# EAGLE design untitled (EAGLE 9.4.2)
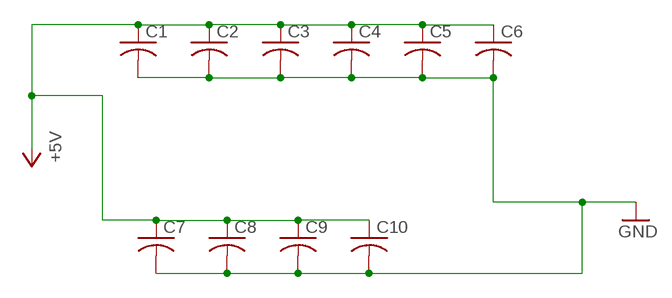
[diagram p0: schematic, sheet 1, part 1 of 2]
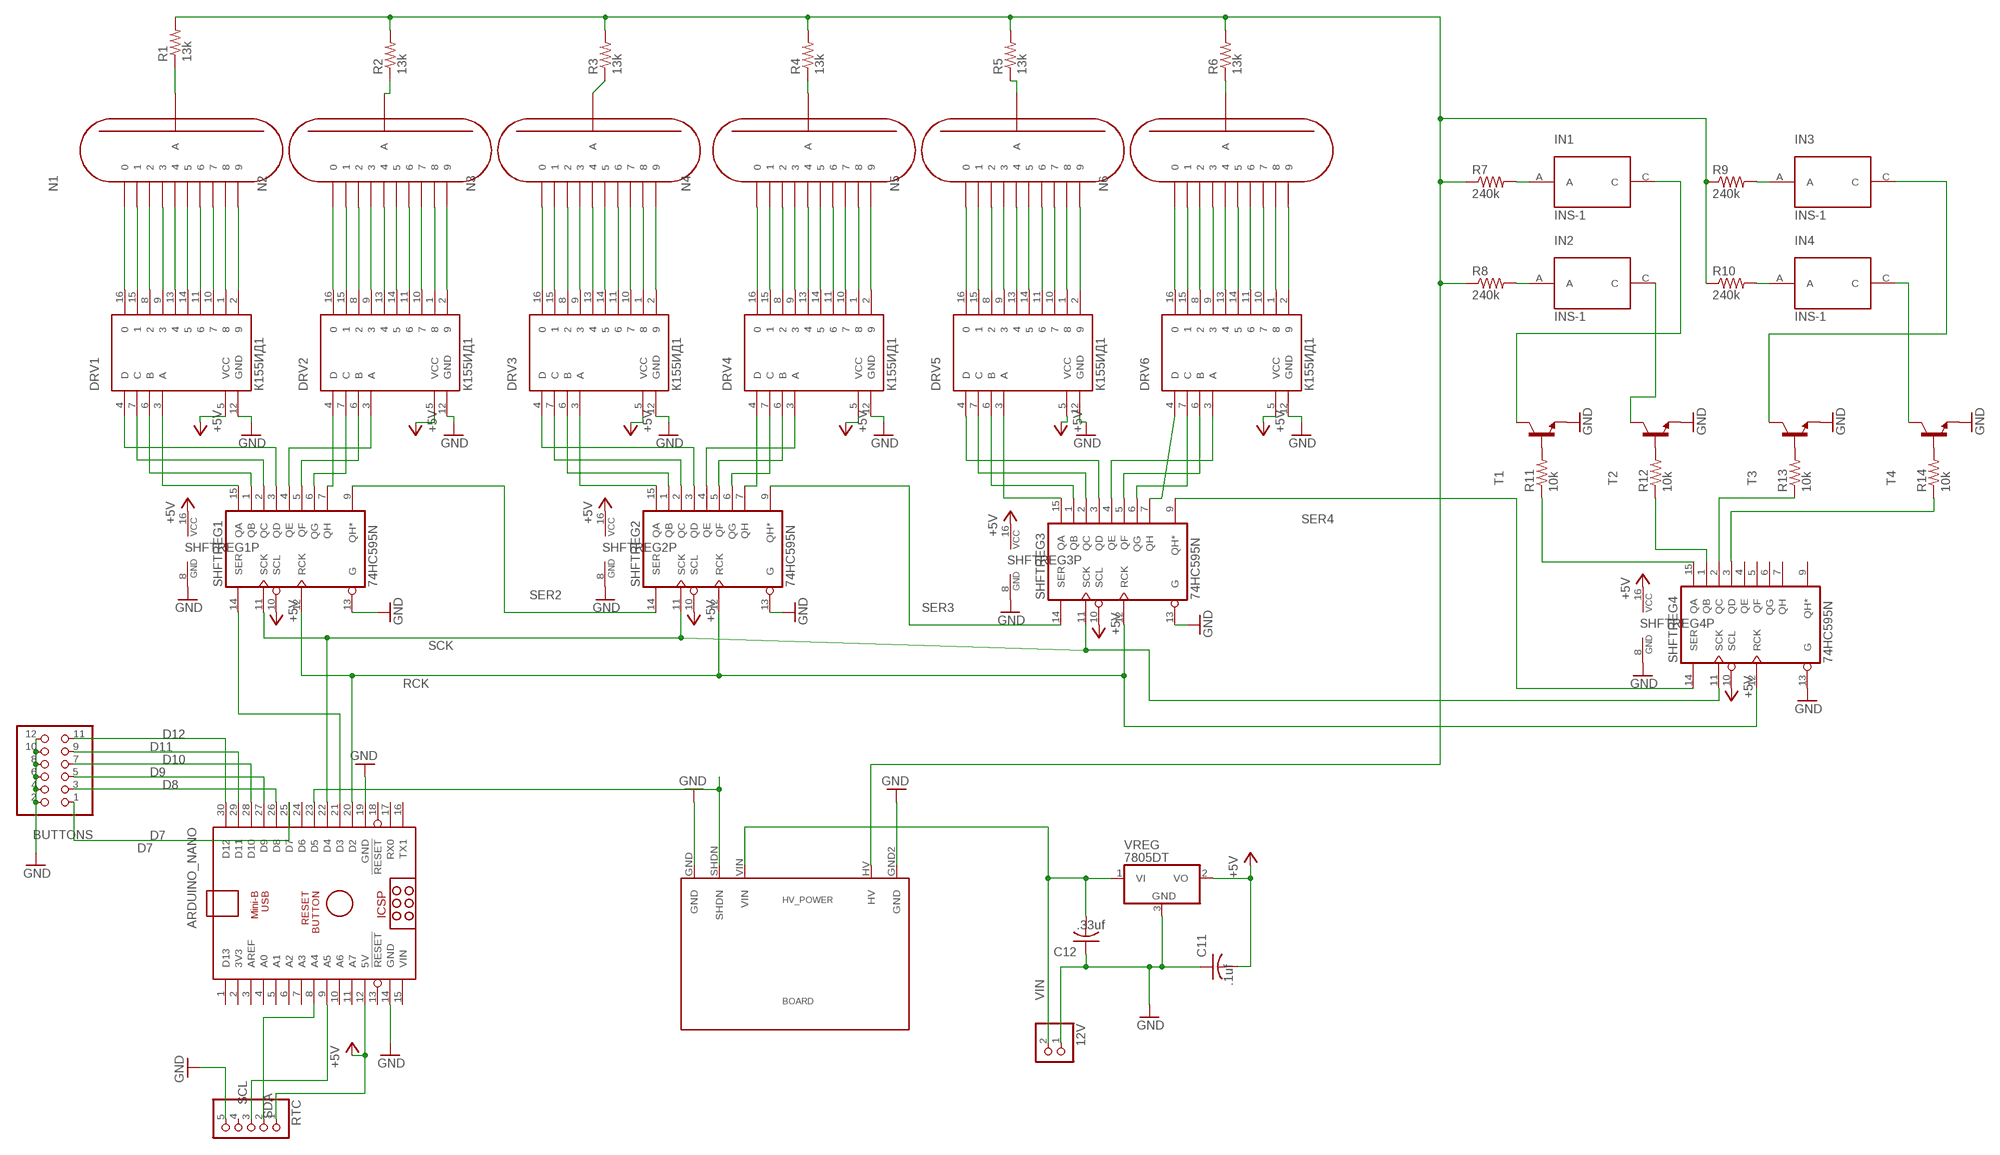
[diagram p1: schematic, sheet 1, part 2 of 2]

## Parts
12V  PINHD-1X2/90  [1X02/90]
ARDUINO_NANO  ARDUINO_NANO  [ARDUINO_NANO]
BUTTONS  PINHD-2X6/90  [2X06/90]
C1  C-USC0805  [C0805]
C2  C-USC0805  [C0805]
C3  C-USC0805  [C0805]
C4  C-USC0805  [C0805]
C5  C-USC0805  [C0805]
C6  C-USC0805  [C0805]
C7  C-USC0805  [C0805]
C8  C-USC0805  [C0805]
C9  C-USC0805  [C0805]
C10  C-USC0805  [C0805]
C11  .1uf  C-USC0805  [C0805]
C12  .33uf  C-USC0805  [C0805]
DRV1  К155ИД1  K155ID1DIL16  [DIL16]
DRV2  К155ИД1  K155ID1DIL16  [DIL16]
DRV3  К155ИД1  K155ID1DIL16  [DIL16]
DRV4  К155ИД1  K155ID1DIL16  [DIL16]
DRV5  К155ИД1  K155ID1DIL16  [DIL16]
DRV6  К155ИД1  K155ID1DIL16  [DIL16]
HV_POWER  BOARD  [BOARD]
IN1  INS-1  [INS-1]
IN2  INS-1  [INS-1]
IN3  INS-1  [INS-1]
IN4  INS-1  [INS-1]
N1  IN-12A  [IN-12]
N2  IN-12A  [IN-12]
N3  IN-12A  [IN-12]
N4  IN-12A  [IN-12]
N5  IN-12A  [IN-12]
N6  IN-12A  [IN-12]
R1  13k  R-US_R0805  [R0805]
R2  13k  R-US_R0805  [R0805]
R3  13k  R-US_R0805  [R0805]
R4  13k  R-US_R0805  [R0805]
R5  13k  R-US_R0805  [R0805]
R6  13k  R-US_R0805  [R0805]
R7  240k  R-US_R0805  [R0805]
R8  240k  R-US_R0805  [R0805]
R9  240k  R-US_R0805  [R0805]
R10  240k  R-US_R0805  [R0805]
R11  10k  R-US_R0805  [R0805]
R12  10k  R-US_R0805  [R0805]
R13  10k  R-US_R0805  [R0805]
R14  10k  R-US_R0805  [R0805]
RTC  PINHD-1X5  [1X05]
SHFTREG1  74HC595N  [DIL16]
SHFTREG2  74HC595N  [DIL16]
SHFTREG3  74HC595N  [DIL16]
SHFTREG4  74HC595N  [DIL16]
T1  MMBTA42LT1-NPN-SOT23-BEC  [SOT23-BEC]
T2  MMBTA42LT1-NPN-SOT23-BEC  [SOT23-BEC]
T3  MMBTA42LT1-NPN-SOT23-BEC  [SOT23-BEC]
T4  MMBTA42LT1-NPN-SOT23-BEC  [SOT23-BEC]
VREG  7805DT  [TO252]

## Nets
+5V: ARDUINO_NANO.12(5V) C1.1 C2.1 C3.1 C4.1 C5.1 C6.1 C7.1 C8.1 C9.1 C10.1 C11.2 DRV1.5(VCC) DRV2.5(VCC) DRV3.5(VCC) DRV4.5(VCC) DRV5.5(VCC) DRV6.5(VCC) RTC.1 SHFTREG1.10(SCL) SHFTREG1.16(VCC) SHFTREG2.10(SCL) SHFTREG2.16(VCC) SHFTREG3.10(SCL) SHFTREG3.16(VCC) SHFTREG4.10(SCL) SHFTREG4.16(VCC) VREG.2(VO)
D7: ARDUINO_NANO.25(D7) BUTTONS.1
D8: ARDUINO_NANO.26(D8) BUTTONS.3
D9: ARDUINO_NANO.27(D9) BUTTONS.5
D10: ARDUINO_NANO.28(D10) BUTTONS.7
D11: ARDUINO_NANO.29(D11) BUTTONS.9
D12: ARDUINO_NANO.30(D12) BUTTONS.11
GND: 12V.1 ARDUINO_NANO.14(GND) ARDUINO_NANO.19(GND) BUTTONS.2 BUTTONS.4 BUTTONS.6 BUTTONS.8 BUTTONS.10 BUTTONS.12 C1.2 C2.2 C3.2 C4.2 C5.2 C6.2 C7.2 C8.2 C9.2 C10.2 C11.1 C12.1 DRV1.12(GND) DRV2.12(GND) DRV3.12(GND) DRV4.12(GND) DRV5.12(GND) DRV6.12(GND) HV_POWER.GND HV_POWER.GND2(GND) RTC.5 SHFTREG1.8(GND) SHFTREG1.13(G) SHFTREG2.8(GND) SHFTREG2.13(G) SHFTREG3.8(GND) SHFTREG3.13(G) SHFTREG4.8(GND) SHFTREG4.13(G) T1.E T2.E T3.E T4.E VREG.3(GND)
N$1: DRV4.4(D) SHFTREG2.7(QH)
N$2: DRV1.16 N1.0
N$3: DRV1.15 N1.1
N$4: DRV1.8 N1.2
N$5: DRV1.9 N1.3
N$6: DRV1.13 N1.4
N$7: DRV1.11 N1.6
N$8: DRV1.14 N1.5
N$9: DRV1.10 N1.7
N$10: DRV1.1 N1.8
N$11: DRV1.2 N1.9
N$12: DRV2.16 N2.0
N$13: DRV2.15 N2.1
N$14: DRV2.8 N2.2
N$15: DRV2.9 N2.3
N$16: DRV2.13 N2.4
N$17: DRV2.14 N2.5
N$18: DRV2.11 N2.6
N$19: DRV2.10 N2.7
N$20: DRV2.1 N2.8
N$21: DRV2.2 N2.9
N$22: DRV3.16 N3.0
N$23: DRV3.15 N3.1
N$24: DRV3.8 N3.2
N$25: DRV3.9 N3.3
N$26: DRV3.13 N3.4
N$27: DRV3.14 N3.5
N$28: DRV3.11 N3.6
N$29: DRV3.10 N3.7
N$30: DRV3.1 N3.8
N$31: DRV3.2 N3.9
N$32: DRV4.16 N4.0
N$33: DRV4.15 N4.1
N$34: DRV4.8 N4.2
N$35: DRV4.9 N4.3
N$36: DRV4.13 N4.4
N$37: DRV4.14 N4.5
N$38: DRV4.11 N4.6
N$39: DRV4.10 N4.7
N$40: DRV4.1 N4.8
N$41: DRV4.2 N4.9
N$42: DRV5.16 N5.0
N$43: DRV5.15 N5.1
N$44: DRV5.8 N5.2
N$45: DRV5.9 N5.3
N$46: DRV5.13 N5.4
N$47: DRV5.11 N5.6
N$48: DRV5.14 N5.5
N$49: DRV5.10 N5.7
N$50: DRV5.1 N5.8
N$51: DRV5.2 N5.9
N$52: DRV6.16 N6.0
N$53: DRV6.15 N6.1
N$54: DRV6.8 N6.2
N$55: DRV6.9 N6.3
N$56: DRV6.13 N6.4
N$57: DRV6.14 N6.5
N$58: DRV6.11 N6.6
N$59: DRV6.10 N6.7
N$60: DRV6.1 N6.8
N$61: DRV1.3(A) SHFTREG1.15(QA)
N$62: DRV1.6(B) SHFTREG1.1(QB)
N$63: DRV1.7(C) SHFTREG1.2(QC)
N$64: DRV1.4(D) SHFTREG1.3(QD)
N$65: DRV2.3(A) SHFTREG1.4(QE)
N$66: DRV2.6(B) SHFTREG1.5(QF)
N$67: DRV2.7(C) SHFTREG1.6(QG)
N$68: DRV2.4(D) SHFTREG1.7(QH)
N$69: ARDUINO_NANO.23(D5) HV_POWER.SHDN
N$70: DRV3.3(A) SHFTREG2.15(QA)
N$71: DRV3.6(B) SHFTREG2.1(QB)
N$72: DRV3.7(C) SHFTREG2.2(QC)
N$73: DRV3.4(D) SHFTREG2.3(QD)
N$74: DRV4.3(A) SHFTREG2.4(QE)
N$75: DRV4.6(B) SHFTREG2.5(QF)
N$76: DRV4.7(C) SHFTREG2.6(QG)
N$77: DRV6.2 N6.9
N$79: DRV5.3(A) SHFTREG3.15(QA)
N$80: DRV5.6(B) SHFTREG3.1(QB)
N$81: DRV5.7(C) SHFTREG3.2(QC)
N$82: DRV5.4(D) SHFTREG3.3(QD)
N$84: DRV6.3(A) SHFTREG3.4(QE)
N$85: DRV6.6(B) SHFTREG3.5(QF)
N$86: DRV6.7(C) SHFTREG3.6(QG)
N$87: DRV6.4(D) SHFTREG3.7(QH)
N$93: IN1.C T1.C
N$94: N1.A R1.1
N$95: N2.A R2.1
N$96: N3.A R3.1
N$97: N4.A R4.1
N$98: N5.A R5.1
N$99: N6.A R6.1
N$101: IN2.A R8.2
N$102: IN1.A R7.2
N$103: IN3.A R9.2
N$104: IN4.A R10.2
N$105: HV_POWER.HV R1.2 R2.2 R3.2 R4.2 R5.2 R6.2 R7.1 R8.1 R9.1 R10.1
N$106: R11.2 T1.B
N$107: R12.2 T2.B
N$108: R13.2 T3.B
N$109: R11.1 SHFTREG4.15(QA)
N$110: R12.1 SHFTREG4.1(QB)
N$111: IN3.C T3.C
N$112: R13.1 SHFTREG4.2(QC)
N$113: R14.1 SHFTREG4.3(QD)
N$114: IN4.C T4.C
N$116: R14.2 T4.B
N$117: IN2.C T2.C
RCK: ARDUINO_NANO.20(D2) SHFTREG1.12(RCK) SHFTREG2.12(RCK) SHFTREG3.12(RCK) SHFTREG4.12(RCK)
SCK: ARDUINO_NANO.22(D4) SHFTREG1.11(SCK) SHFTREG2.11(SCK) SHFTREG3.11(SCK) SHFTREG4.11(SCK)
SCL: ARDUINO_NANO.9(A5) RTC.3
SDA: ARDUINO_NANO.8(A4) RTC.2
SER1: ARDUINO_NANO.21(D3) SHFTREG1.14(SER)
SER2: SHFTREG1.9(QH*) SHFTREG2.14(SER)
SER3: SHFTREG2.9(QH*) SHFTREG3.14(SER)
SER4: SHFTREG3.9(QH*) SHFTREG4.14(SER)
VIN: 12V.2 C12.2 HV_POWER.VIN VREG.1(VI)
Unconnected: ARDUINO_NANO.1(D13) ARDUINO_NANO.2(3V3) ARDUINO_NANO.3(AREF) ARDUINO_NANO.4(A0) ARDUINO_NANO.5(A1) ARDUINO_NANO.6(A2) ARDUINO_NANO.7(A3) ARDUINO_NANO.10(A6) ARDUINO_NANO.11(A7) ARDUINO_NANO.13(!RESET) ARDUINO_NANO.16(TX1) ARDUINO_NANO.17(RX0) ARDUINO_NANO.18(!RESET) ARDUINO_NANO.24(D6) RTC.4 SHFTREG4.4(QE) SHFTREG4.5(QF) SHFTREG4.6(QG) SHFTREG4.7(QH) SHFTREG4.9(QH*)

## Power pins joined to a net without a drawn wire
VIN: ARDUINO_NANO.15(VIN)

## Library data of the parts
12V = pinhead:PINHD-1X2: PIN HEADER
ARDUINO_NANO = ArduinoNanoV30:ARDUINO_NANO: Arduino Nano V3.0 Overview: The Arduino Nano is a small, complete, and breadboard-friendly board based on the ATmega328 (Arduino Nano 3.x) or ATmega168 (Arduino Nano 2.x). It has more or less the same functionality of the Arduino Duemilanove, but in a different package. It lacks only a DC power jack, and works with a Mini-B USB cable instead of a standard one. The Nano was designed and is being produced by Gravitech. Specifications: Microcontroller Atmel ATmega168 or ATmega328 Operating Voltage (logic level) 5 V Input Voltage (recommended) 7-12 V Input Voltage (limits) 6-20 V Digital I/O Pins 14 (of which 6 provide PWM output) Analog Input Pins 8 DC Current per I/O Pin 40 mA Flash Memory 16 KB (ATmega168) or 32 KB (ATmega328) of which 2 KB used by bootloader SRAM 1 KB (ATmega168) or 2 KB (ATmega328) EEPROM 512 bytes (ATmega168) or 1 KB (ATmega328) Clock Speed 16 MHz Dimensions 0.73" x 1.70" Length 45 mm Width 18 mm Weigth 5 g Power: The Arduino Nano can be powered via the Mini-B USB connection, 6-20V unregulated external power supply (pin 30), or 5V regulated external power supply (pin 27). The power source is automatically selected to the highest voltage source. Memory: The ATmega168 has 16 KB of flash memory for storing code (of which 2 KB is used for the bootloader); the ATmega328 has 32 KB, (also with 2 KB used for the bootloader). The ATmega168 has 1 KB of SRAM and 512 bytes of EEPROM (which can be read and written with the EEPROM library); the ATmega328 has 2 KB of SRAM and 1 KB of EEPROM. Input and Output: Each of the 14 digital pins on the Nano can be used as an input or output, using pinMode(), digitalWrite(), and digitalRead() functions. They operate at 5 volts. Each pin can provide or receive a maximum of 40 mA and has an internal pull-up resistor (disconnected by default) of 20-50 kOhms. In addition, some pins have specialized functions. Visit Arduino - ArduinoBoardNano <https://www.arduino.cc/en/Main/ArduinoBoardNano>
BUTTONS = pinhead:PINHD-2X6: PIN HEADER
C1-C12 = rcl:C-US: CAPACITOR, American symbol; SPICEPREFIX: C
DRV1-DRV6 = Nixie:K155ID1
HV_POWER = nixiePowerSupply:BOARD
IN1-IN4 = Nixie:INS-1
N1-N6 = nixie12:IN-12A: IN-12A Nixie Tube Russian nixie tubes. IN-12A. DSUB Version.
R1-R14 = rcl:R-US_: RESISTOR, American symbol; SPICEPREFIX: R
RTC = pinhead:PINHD-1X5: PIN HEADER
SHFTREG1-SHFTREG4 = 74xx-eu:74*595: 8-bit SHIFT REGISTER, output latch
T1-T4 = transistor:*-NPN-: NPN Transistror BF959 corrected 2008.03.06
VREG = linear:78*: Positive VOLTAGE REGULATOR Source: http://cache.national.com/ds/LM/LM78L05.pdf http://www.fairchildsemi.com/ds/LM/LM7805.pdf

## Board
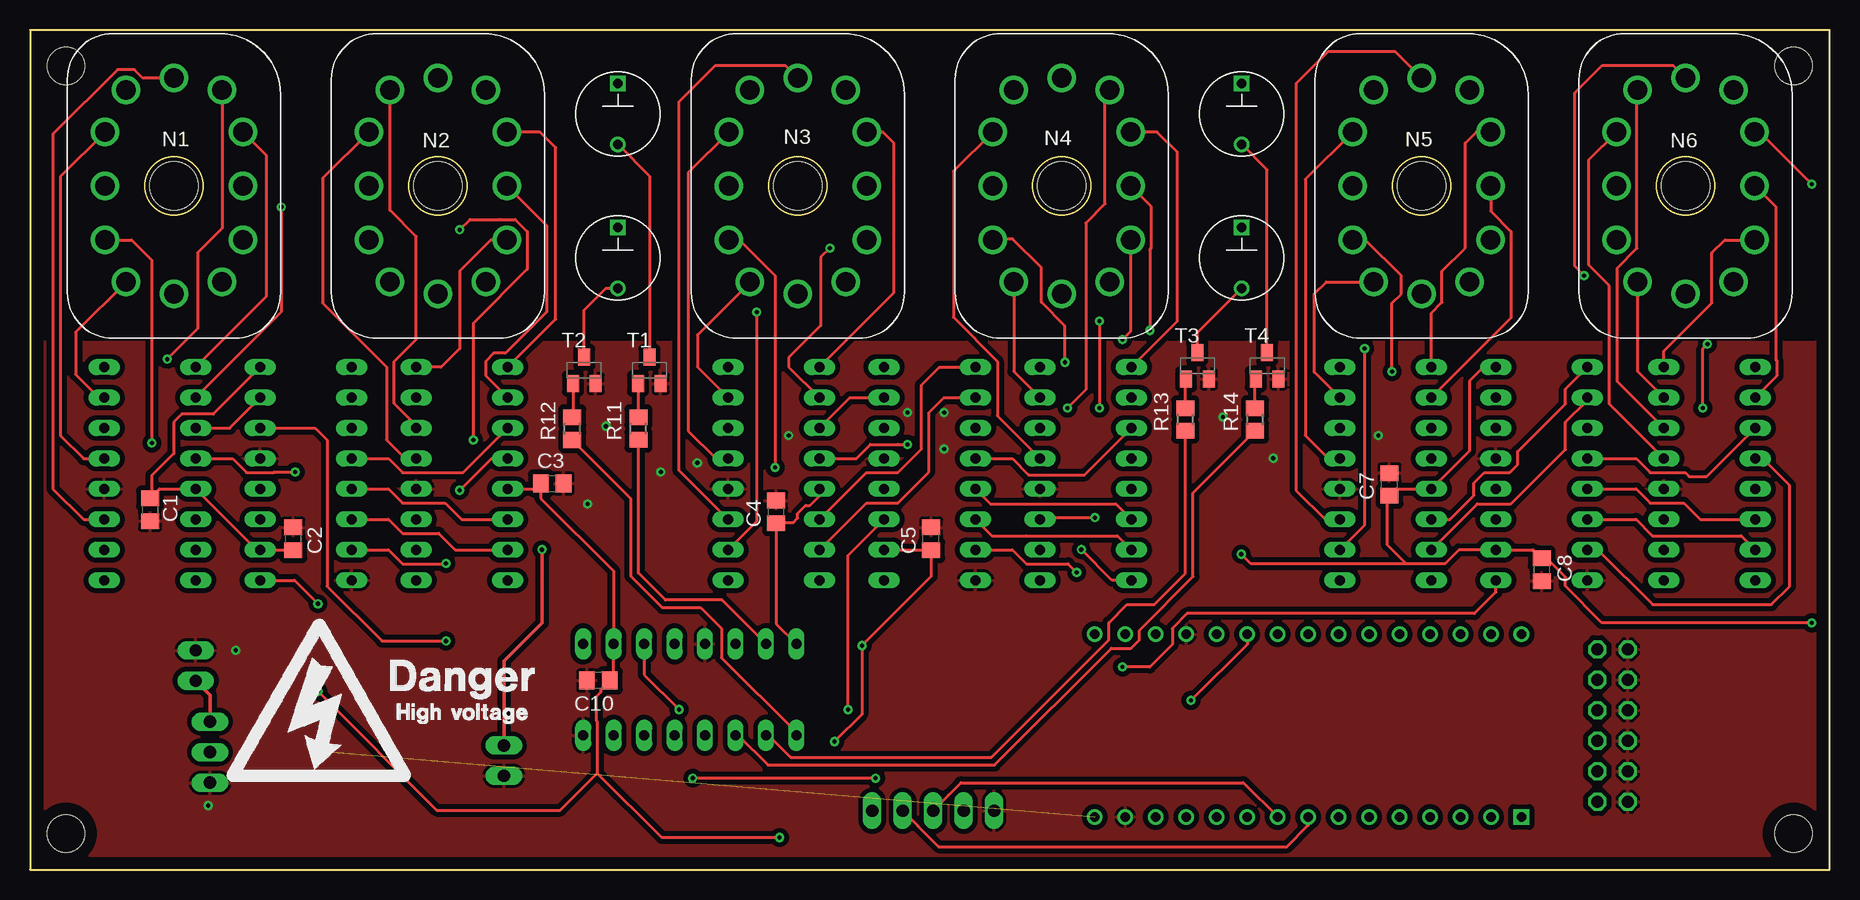
[diagram p2: board, top side]
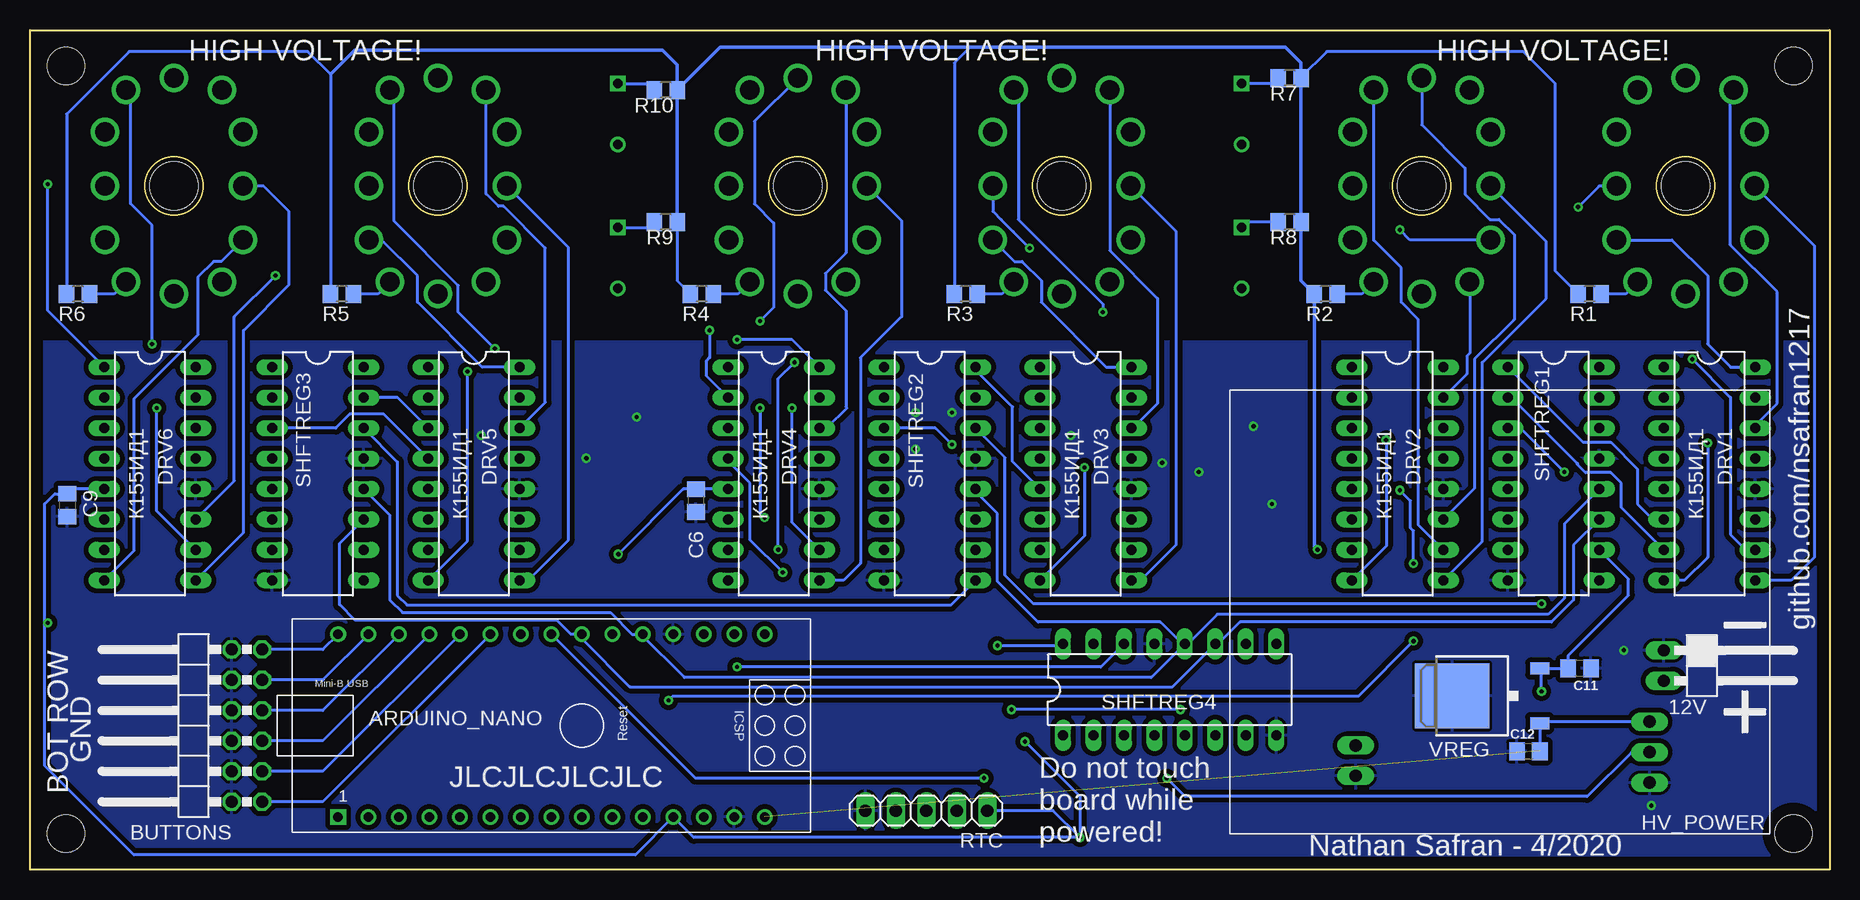
[diagram p3: board, bottom side, seen from below]

Size 150 x 70 mm. Coordinates in mm from the lower left corner, seen from the top.
Outline: 0,0 150,0 150,70 0,70 0,0
Copper layers (1*16): Top 0.035mm / dielectric 1.5mm / Bottom 0.035mm
Design rules "default *": minimum track width 10mil, minimum drill 0.35mm, track to track 15mil, track to pad 15mil, pad to pad 15mil, via to via 15mil, smd to smd 15mil, copper to edge 40mil, drill to drill 6mil, minimum pad ring 10mil, minimum via ring 8mil, stop-mask expansion 4mil, vias tented up to drill 0mil, thermal gap 10mil
Holes 3.1 mm at 3,67 3,3 147,67 147,3
Holes 4 mm at 12,57 34,57 64,57 86,57 116,57 138,57

### Footprints (pad centres in the part's own frame; a part is rotated, then mirrored left to right if it is on the bottom)
1X02/90 = drill 1.016 long: 1 -1.27,-3.81; 2 1.27,-3.81
ARDUINO_NANO = drill 0.8 square: 1 -20.32,-7.62 | drill 0.8: 2 -17.78,-7.62; 3 -15.24,-7.62; 4 -12.7,-7.62; 5 -10.16,-7.62; 6 -7.62,-7.62; 7 -5.08,-7.62; 8 -2.54,-7.62; 9 0,-7.62; 10 2.54,-7.62; 11 5.08,-7.62; 12 7.62,-7.62; 13 10.16,-7.62; 14 12.7,-7.62; 15 15.24,-7.62; 16 15.24,7.62; 17 12.7,7.62; 18 10.16,7.62; 19 7.62,7.62; 20 5.08,7.62; 21 2.54,7.62; 22 0,7.62; 23 -2.54,7.62; 24 -5.08,7.62; 25 -7.62,7.62; 26 -10.16,7.62; 27 -12.7,7.62; 28 -15.24,7.62; 29 -17.78,7.62; 30 -20.32,7.62
2X06/90 = drill 1.016 octagon: 1 -6.35,-6.35; 2 -6.35,-3.81; 3 -3.81,-6.35; 4 -3.81,-3.81; 5 -1.27,-6.35; 6 -1.27,-3.81; 7 1.27,-6.35; 8 1.27,-3.81; 9 3.81,-6.35; 10 3.81,-3.81; 11 6.35,-6.35; 12 6.35,-3.81
C0805 = smd 1.3 x 1.5: 1 -0.95,0; 2 0.95,0
DIL16 = drill 0.813 long: 1 -8.89,-3.81; 2 -6.35,-3.81; 3 -3.81,-3.81; 4 -1.27,-3.81; 5 1.27,-3.81; 6 3.81,-3.81; 7 6.35,-3.81; 8 8.89,-3.81; 9 8.89,3.81; 10 6.35,3.81; 11 3.81,3.81; 12 1.27,3.81; 13 -1.27,3.81; 14 -3.81,3.81; 15 -6.35,3.81; 16 -8.89,3.81
BOARD = drill 1.016 long: GND 10,32.75; GND2 34.5,32.2; HV 34.5,29.66; SHDN 10,30.21; VIN 10,27.67
INS-1 = drill 0.8 square: A 0,2.54 | drill 0.8: C 0,-2.54
IN-12 = drill 1.6 pad 2.4: 0 5.75,-4.5; 1 -4,-8; 2 -5.75,-4.5; 3 -5.75,0; 4 -5.75,4.5; 5 -4,8; 6 0,9; 7 4,8; 8 5.75,4.5; 9 5.75,0; A 4,-8; DP 0,-9
R0805 = smd 1.3 x 1.5: 1 -0.95,0; 2 0.95,0
1X05 = drill 1.016 long: 1 -5.08,0; 2 -2.54,0; 3 0,0; 4 2.54,0; 5 5.08,0
SOT23-BEC = smd 1 x 1.4: B -0.95,-1.1; C 0,1.1; E 0.95,-1.1
TO252 = smd 1 x 1.6: 1 -2.28,-4.8; 2 2.28,-4.8 | smd 5.4 x 6.2: 3 0,2.5

### Placement (x,y rotation side)
12V  10,17 270 bottom
ARDUINO_NANO  104,12 0 bottom
BUTTONS  137,12 90 bottom
C1  21.96,27.58 90 top
C2  10,30 270 top
C3  43.53,32.19 0 top
C4  62.21,29.82 90 top
C5  75.11,27.58 90 top
C6  94.5,30.76 270 bottom
C7  113.31,32.1 90 top
C8  126,25 270 top
C9  146.89,30.38 270 bottom
C10  47.38,15.76 180 top
C11  20.83,16.76 180 bottom
C12  25.09,9.87 0 bottom
DRV1  10,33 270 bottom
DRV2  36,33 270 bottom
DRV3  62,33 270 bottom
DRV4  88,33 270 bottom
DRV5  113,33 270 bottom
DRV6  140,33 270 bottom
HV_POWER  5,40 180 bottom
IN1  49,63 0 top
IN2  49,51 0 top
IN3  101,51 0 top
IN4  101,63 0 top
N1  12,57 0 top
N2  34,57 0 top
N3  64,57 0 top
N4  86,57 0 top
N5  116,57 0 top
N6  138,57 0 top
R1  20,48 180 bottom
R2  42,48 180 bottom
R3  72,48 180 bottom
R4  94,48 180 bottom
R5  124,48 180 bottom
R6  146,48 180 bottom
R7  45,66 180 bottom
R8  45,54 180 bottom
R9  97,54 180 bottom
R10  97,65 180 bottom
R11  50.71,36.77 90 top
R12  45.2,36.76 90 top
R13  96.31,37.52 90 top
R14  102.12,37.52 90 top
RTC  75.29,4.91 180 bottom
SHFTREG1  23,33 270 bottom
SHFTREG2  75,33 270 bottom
SHFTREG3  126,33 270 bottom
SHFTREG4  55,15 0 bottom
T1  51.63,41.62 0 top
T2  46.2,41.62 0 top
T3  97.31,42 0 top
T4  103.12,42 0 top
U$1  [HV]  16.38,6.86 0 top
VREG  28.96,14.48 90 bottom

### Tracks (layer width: path | path; a pad name or v marks a point on that pad's centre or on a via)
+5V  (via drill 0.35)
  Top 0.254: C2.1 10.16,31.11 | 10.16,31.11 10.78,31.73 DRV1.5 18.89,26.65 SHFTREG1.10 21.94,26.65 C1.1 | 10.16,31.11 10.16,32.86 11.98,34.68 11.98,37.29 12.67,37.98 15.28,37.98 SHFTREG1.16 | SHFTREG3.16 121.14,41.89 120.02,40.77 120.02,34.94 DRV5.5 113.89,31.73 C7.1 113.16,31 113.16,27.05 114.73,25.48 | DRV2.5 42.12,31.73 C3.1 42.58,30.95 48.65,24.88 SHFTREG4.10 48.65,16.08 C10.1 47.59,15.02 47.59,14.8 47.24,14.46 47.24,12.37 47.28,12.33 47.28,8.04 | 125.89,26.06 125.3,26.65 SHFTREG3.10 119.12,26.65 117.95,25.48 114.73,25.48 | 125.89,26.06 C8.1 | v24,14.86 33.91,4.95 44.2,4.95 47.28,8.04 | 47.28,8.04 52.65,2.67 v62.48,2.67 | SHFTREG2.10 75.09,26.65 C5.1 75.11,24.44 v69.34,18.67 69.34,12.95 v67.06,10.67 | v148.53,20.57 131.03,20.57 127.98,23.63 127.98,24.38 126.3,26.06 125.89,26.06 | 114.73,25.48 101.77,25.48 v100.97,26.29 | DRV3.5 65.81,31.14 65.03,30.36 64.67,30.36 63.98,29.67 63.98,29.31 63.63,28.96 62.3,28.96 C4.1 62.21,20.49 SHFTREG4.16
  Bottom 0.254: DRV3.5 68.09,34.01 68.09,38.56 71.19,41.66 SHFTREG2.16 | DRV6.5 146.49,31.73 C9.1 147.93,31.33 148.78,30.48 148.78,20.57 | SHFTREG1.10 16.76,24.22 16.76,22.86 21.78,17.85 C11.2 VREG.2 24,16.61 v24,14.86 | v62.48,2.67 94.67,2.67 ARDUINO_NANO.12 99.54,1.22 141.35,1.22 148.78,8.65 148.78,20.57 | 148.78,20.57 v148.53,20.57 | v100.97,26.29 95.54,31.71 C6.1 94.48,31.73 DRV4.5 | v69.34,18.67 64.03,18.67 SHFTREG4.16 | v67.06,10.67 62.48,6.1 v62.48,2.67 | v62.48,2.67 64.72,4.91 RTC.1
D7
  Bottom 0.254: ARDUINO_NANO.25 125.59,5.65 BUTTONS.1
D8
  Bottom 0.254: ARDUINO_NANO.26 125.59,8.19 BUTTONS.3
D9
  Bottom 0.254: ARDUINO_NANO.27 125.59,10.73 BUTTONS.5
D10
  Bottom 0.254: ARDUINO_NANO.28 125.59,13.27 BUTTONS.7
D11
  Bottom 0.254: ARDUINO_NANO.29 125.59,15.81 BUTTONS.9
D12
  Bottom 0.254: ARDUINO_NANO.30 125.59,18.35 BUTTONS.11
GND  (via drill 0.35)
  other vias: 48.01,36.96 46.48,30.48 55.63,33.91 63.25,36.2 76.2,35.05 76.2,38.1 112.39,36.2 99.44,37.72 52.58,33.15 73.15,38.1 17.14,18.29 14.86,5.33 103.63,34.29
  pour Bottom (isolate 0.406): 0,44 150,44 150,0 0,0
  pour Top (isolate 0.406): 0,44 150,44 150,0 0,0
N$1  (via drill 0.35)
  Top 0.254: SHFTREG2.7 81.88,26.65 83.05,25.48 86.53,25.48 v87.25,24.77
  Bottom 0.254: v87.25,24.77 89.98,27.5 89.98,32.21 91.81,34.04 DRV4.4
N$2
  Bottom 0.254: N1.0 13.13,52.5 10.16,49.53 10.16,43.81 8.23,41.89 DRV1.16
N$3
  Top 0.254: N1.1 3.81,44.81 3.81,41.27 5.74,39.35 DRV1.15
N$4  (via drill 0.35)
  Top 0.254: N1.2 8.46,52.5 10.16,50.8 v10.16,35.56
  Bottom 0.254: v10.16,35.56 10.16,26.04 12.09,24.11 DRV1.8
N$5
  Bottom 0.254: N1.3 1.27,52.02 1.27,26.04 3.19,24.11 DRV1.9
N$6
  Top 0.254: N1.4 2.54,57.79 2.54,36.2 4.46,34.27 DRV1.13
N$7
  Top 0.254: N1.6 9.41,66 8.71,66.71 7.29,66.71 1.91,61.32 1.91,31.75 4.46,29.19 DRV1.11
N$8
  Bottom 0.254: DRV1.14 6.19,37.04 4.36,38.87 4.36,48.18 8.26,52.07 8.26,64.75 N1.5
N$9  (via drill 0.35)
  Top 0.254: N1.7 16,53.47 13.97,51.44 13.97,45.09 v11.43,42.55
  Bottom 0.254: v11.43,42.55 8.26,39.37 8.26,27.94 6.96,26.65 DRV1.10
N$10
  Top 0.254: N1.8 19.68,59.56 19.68,47.77 DRV1.1
N$11  (via drill 0.35)
  Top 0.254: v20.95,55.24 20.95,46.49 DRV1.2
  Bottom 0.254: N1.9 19.2,57 v20.95,55.24
N$12
  Top 0.254: N2.0 38.4,52.5 35.81,49.91 35.81,43.43 34.27,41.89 DRV2.16
N$13
  Bottom 0.254: N2.1 30,43.04 30.23,42.82 30.23,41.31 DRV2.15
N$14  (via drill 0.35)
  Top 0.254: v36.96,35.81 36.96,45.54 41.46,50.04 41.46,53.21 40.46,54.21 39.24,54.21 39.04,54.21 36.68,54.21 v35.81,53.34
  Bottom 0.254: N2.2 34.97,52.5 v35.81,53.34 | DRV2.8 36.96,26.96 v36.96,35.81
N$15
  Bottom 0.254: DRV2.9 28.96,27.34 28.96,42.29 23.62,47.62 23.62,52.37 N2.3
N$16
  Top 0.254: N2.4 24.38,57.63 24.38,47.24 29.72,41.91 29.72,35.81 31.26,34.27 DRV2.13
N$17
  Top 0.254: DRV2.14 32.19,37.04 30.36,38.87 30.36,42.37 32.19,44.2 32.19,52.77 30,54.96 N2.5
N$18
  Bottom 0.254: N2.6 34,62.1 30.39,58.49 30.39,56.3 28.3,54.21 27.54,54.21 26.29,52.95 26.29,45.86 29.59,42.55 29.59,31.79 DRV2.11
N$19
  Bottom 0.254: DRV2.10 34.29,28.75 34.29,45.88 35.71,47.29 35.71,50.19 38,52.48 N2.7
N$20
  Top 0.254: DRV2.1 43.81,45.9 43.81,60.2 42.51,61.5 N2.8
N$21
  Top 0.254: N2.9 43.05,53.7 43.05,46.48 39.63,43.06 38.67,43.06 37.98,42.37 37.98,41.18 DRV2.2
N$22
  Bottom 0.254: N3.0 67.96,50.71 67.29,50.71 65.71,49.12 65.71,47.29 60.3,41.89 DRV3.16
N$23
  Top 0.254: N3.1 60,48.95 55.63,44.58 55.63,41.91 DRV3.15
N$24  (via drill 0.35)
  Top 0.254: N3.2 59.13,52.5 62.1,49.53 v62.1,33.53
  Bottom 0.254: v62.1,33.53 62.1,27.82 DRV3.8
N$25
  Bottom 0.254: N3.3 54.48,53.23 54.48,27.05 57.42,24.11 DRV3.9
N$26
  Top 0.254: N3.4 54.86,58.11 54.86,36.58 57.17,34.27 DRV3.13
N$27
  Bottom 0.254: N3.5 60,51.62 56.01,47.62 56.01,38.86 58.06,36.81 DRV3.14
N$28
  Top 0.254: DRV3.11 54.1,33.28 54.1,64.01 57.15,67.06 62.94,67.06 N3.6
N$29  (via drill 0.35)
  Top 0.254: v60.58,46.48 60.58,29.04 DRV3.10
  Bottom 0.254: N3.7 67.61,64.61 67.61,54.19 60.58,47.16 v60.58,46.48
N$30
  Top 0.254: DRV3.1 72.01,48.09 72.01,60.58 71.09,61.5 N3.8
N$31  (via drill 0.35)
  Top 0.254: v66.67,51.82 65.91,51.05 65.91,45.34 63.25,42.67 63.25,41.91 DRV3.2
  Bottom 0.254: N3.9 69.75,54.89 69.07,54.21 69.04,54.21 68.04,53.21 68.04,53.18 v66.67,51.82
N$32  (via drill 0.35)
  Top 0.254: v91.06,44.2 91.75,44.89 N4.0
  Bottom 0.254: DRV4.16 86.5,44.2 v91.06,44.2
N$33
  Top 0.254: N4.1 82,41.54 DRV4.15
N$34  (via drill 0.35)
  Top 0.254: DRV4.8 90.19,24.11 v87.63,26.67 | v86.27,42.29 86.27,45.31 84.29,47.29 84.29,50.2 81.92,52.58 80.33,52.58 N4.2
  Bottom 0.254: v87.63,26.67 87.63,40.93 v86.27,42.29
N$35
  Bottom 0.254: N4.3 77.34,54.09 77.34,46.1 80.77,42.67 80.77,25.53 82.19,24.11 DRV4.9
N$36
  Top 0.254: N4.4 76.96,58.21 76.96,46.05 80.64,42.37 80.64,37.82 DRV4.13
N$37
  Bottom 0.254: N4.5 82,51.41 83.71,49.71 83.71,48.29 82,46.59 82,38.57 81.92,38.48 83.59,36.81 DRV4.14
N$38  (via drill 0.35)
  Top 0.254: DRV4.11 84.34,29.34 v88.77,29.34 | v89.15,45.72 v89.15,38.48
  Bottom 0.254: N4.6 89.61,62.39 89.61,55.51 88.01,53.91 88.01,46.86 v89.15,45.72 | v89.15,38.48 89.15,29.72 v88.77,29.34
N$39  (via drill 0.35)
  Top 0.254: v86.49,38.48 88.01,40.01 88.01,53.91 89.61,55.51 89.61,64.61 N4.7
  Bottom 0.254: DRV4.10 86.49,28.95 v86.49,38.48
N$40
  Top 0.254: DRV4.1 95.63,45.71 95.63,59.82 93.95,61.5 N4.8
N$41  (via drill 0.35)
  Top 0.254: v93.34,44.96 93.34,51.68 93.46,51.79 93.46,55.29 N4.9
  Bottom 0.254: v93.34,44.96 93.34,42.67 93.64,42.37 93.64,41.18 DRV4.2
N$42
  Bottom 0.254: DRV5.16 112.31,41.89 117.71,47.29 117.71,49.51 120.7,52.5 N5.0
N$43
  Top 0.254: DRV5.15 107.06,41.48 107.06,48.01 108.06,49 N5.1
N$44  (via drill 0.35)
  Top 0.254: v113.54,41.53 113.54,47.24 114.29,48 114.29,49.54 111.33,52.5 N5.2
  Bottom 0.254: DRV5.8 113.54,27.38 v113.54,41.53
N$45
  Bottom 0.254: N5.3 105.16,51.91 105.16,27.43 108.48,24.11 DRV5.9
N$46
  Top 0.254: N5.4 106.3,57.55 106.3,36.2 108.22,34.27 DRV5.13
N$47
  Top 0.254: N5.6 113.8,68.2 108.2,68.2 105.54,65.53 105.54,31.62 107.97,29.19 DRV5.11
N$48
  Bottom 0.254: DRV5.14 107.06,38.94 107.06,51.82 110.54,55.29 110.96,55.29 112,56.34 N5.5
N$49  (via drill 0.35)
  Top 0.254: DRV5.10 111.25,28.71 v111.25,43.43
  Bottom 0.254: v111.25,43.43 114.29,46.47 114.29,48.71 119.63,54.05 119.63,65.15 119.85,65.15 N5.7
N$50
  Top 0.254: DRV5.1 116.81,46.4 117.71,47.29 117.71,49.89 119.63,51.82 119.63,60.58 120.56,61.5 N5.8
N$51
  Top 0.254: N5.9 121.75,54.91 123.46,53.21 123.46,46 DRV5.2
N$52
  Top 0.254: DRV6.16 136.19,43.23 140.21,47.24 140.21,51.44 141.27,52.5 N6.0
N$53
  Top 0.254: DRV6.15 134,41.54 N6.1
N$54
  Bottom 0.254: N6.2 134.04,50.71 134.71,50.71 136.02,49.4 136.02,44.58 141.35,39.24 141.35,26.57 DRV6.8
N$55
  Bottom 0.254: DRV6.9 132.21,28.09 132.21,44.96 128.4,48.77 128.4,54.86 130.53,57 N6.3
N$56
  Top 0.254: DRV6.13 131.64,38.82 131.64,48.68 129.92,50.4 129.92,59.17 N6.4
N$57
  Top 0.254: DRV6.14 132.29,40.71 132.29,50.13 133.96,51.79 133.96,64.96 N6.5
N$58  (via drill 0.35)
  Top 0.254: v129.54,49.53 128.78,50.29 128.78,64.77 131.06,67.06 136.94,67.06 N6.6
  Bottom 0.254: DRV6.11 132.97,32.41 132.97,46.1 v129.54,49.53
N$59  (via drill 0.35)
  Top 0.254: v139.45,38.48 139.45,43.43 v139.83,43.81
  Bottom 0.254: DRV6.10 139.45,29.91 v139.45,38.48 | v139.83,43.81 139.83,53.73 141.61,55.51 141.61,64.61 N6.7
N$60  (via drill 0.35)
  Top 0.254: v148.53,57.15 144.18,61.5 N6.8
  Bottom 0.254: DRV6.1 148.53,46.61 v148.53,57.15
N$61
  Top 0.254: DRV1.3 16.65,36.81 SHFTREG1.15
N$62
  Bottom 0.254: SHFTREG1.1 20.56,35.64 18.25,35.64 16,33.4 16,30.48 14.71,29.19 DRV1.6
N$63
  Bottom 0.254: SHFTREG1.2 26.51,39.35 21.02,33.86 21.02,33.79 20.33,33.1 18.25,33.1 17.36,32.21 17.36,30.2 DRV1.7
N$64  (via drill 0.35)
  Top 0.254: DRV1.4 16.88,34.27 18.05,33.1 20.33,33.1 20.38,33.15 v22.1,33.15
  Bottom 0.254: v22.1,33.15 25.76,36.81 SHFTREG1.3
N$65
  Top 0.254: SHFTREG1.4 29.88,34.27 31.05,33.1 36.1,33.1 DRV2.3
N$66
  Top 0.254: SHFTREG1.5 29.88,31.73 31.05,30.56 34.59,30.56 35.96,29.19 DRV2.6
N$67
  Top 0.254: SHFTREG1.6 29.88,29.19 31.05,28.02 34.08,28.02 35.45,26.65 DRV2.7
N$68  (via drill 0.35)
  Top 0.254: SHFTREG1.7 29.88,26.65 31.05,25.48 34.63,25.48 v34.67,25.53 | v35.81,31.62 38.46,34.27 DRV2.4
  Bottom 0.254: v34.67,25.53 34.67,28.23 34.92,28.49 34.92,30.73 v35.81,31.62
N$69  (via drill 0.35)
  Top 0.254: v70.48,7.62 v55.24,7.62
  Bottom 0.254: v55.24,7.62 53.72,6.1 20.19,6.1 16.5,9.79 HV_POWER.SHDN | v70.48,7.62 94.54,7.62 ARDUINO_NANO.23
N$70
  Top 0.254: DRV3.3 68.35,39.35 SHFTREG2.15
N$71
  Top 0.254: DRV3.6 69.72,33.1 72.33,33.1 74.3,35.06 74.3,40.39 75.8,41.89 SHFTREG2.1
N$72
  Top 0.254: DRV3.7 69.72,30.56 72.33,30.56 74.93,33.16 74.93,38.1 76.18,39.35 SHFTREG2.2
N$73  (via drill 0.35)
  Top 0.254: DRV3.4 68.88,34.27 70.05,35.44 72.33,35.44 72.34,35.43 v73.15,35.43
  Bottom 0.254: v73.15,35.43 74.53,36.81 SHFTREG2.3
N$74
  Top 0.254: SHFTREG2.4 81.88,34.27 83.25,32.9 87.9,32.9 DRV4.3
N$75
  Top 0.254: SHFTREG2.5 80.06,30.48 90.52,30.48 DRV4.6
N$76
  Top 0.254: SHFTREG2.6 80.19,27.81 83.04,27.81 83.05,27.82 90.64,27.82 DRV4.7
N$77
  Top 0.254: DRV6.2 145.64,41.18 145.64,42.37 145.54,42.47 145.54,55.24 143.79,57 N6.9
N$79
  Bottom 0.254: DRV5.3 119.35,39.35 SHFTREG3.15
N$80
  Top 0.254: DRV5.6 118.34,29.19 120.36,31.21 120.36,32.21 121.25,33.1 123.33,33.1 124.02,33.79 124.02,34.87 128,38.85 127.98,38.87 127.98,40.06 SHFTREG3.1
N$81
  Top 0.254: DRV5.7 120.64,30.48 123.44,30.48 127.98,35.02 127.98,37.29 129.81,39.12 SHFTREG3.2
N$82
  Bottom 0.254: SHFTREG3.3 124.5,36.81 123.33,37.98 120.52,37.98 DRV5.4
N$84
  Top 0.254: SHFTREG3.4 133.88,34.27 135.05,33.1 137.97,33.1 138.3,32.77 139.77,32.77 DRV6.3
N$85
  Top 0.254: SHFTREG3.5 133.88,31.73 135.05,30.56 137.84,30.56 139.21,29.19 DRV6.6
N$86
  Top 0.254: SHFTREG3.6 133.88,29.19 135.25,27.82 142.64,27.82 DRV6.7
N$87
  Top 0.254: SHFTREG3.7 130.7,26.65 135.25,22.1 145.16,22.1 146.69,23.62 146.69,32 144.42,34.27 DRV6.4
N$93
  Top 0.254: IN1.C 51.63,57.83 T1.C
N$94
  Bottom 0.254: N1.A 17,48 R1.1
N$95
  Bottom 0.254: N2.A 39,48 R2.1
N$96
  Bottom 0.254: N3.A 69,48 R3.1
N$97
  Bottom 0.254: N4.A 91,48 R4.1
N$98
  Bottom 0.254: N5.A 121,48 R5.1
N$99
  Bottom 0.254: N6.A 143,48 R6.1
N$101
  Bottom 0.254: R8.2 48.54,54 IN2.A
N$102
  Bottom 0.254: R7.2 46.41,65.54 IN1.A
N$103
  Bottom 0.254: R9.2 98.41,53.54 IN3.A
N$104
  Bottom 0.254: R10.2 98.49,65.54 IN4.A
N$105  (via drill 0.35)
  Top 0.305: v42.67,26.67 42.67,20.57 39.5,17.4 HV_POWER.HV
  Bottom 0.254: R1.2 22.86,49.91 22.86,65.53 25.53,68.2 41.91,68.2 44.05,66.06 R7.1 | 71.63,68.58 72.95,67.26 R3.2 | R9.1 96.05,49.1 R4.2 | R5.2 124.95,66.31 126.84,68.2 141.73,68.2 146.95,62.98 R6.2
  Bottom 0.305: v42.67,26.67 42.95,26.95 R2.2 44.05,49.1 R8.1 R7.1 44.05,67.29 45.34,68.58 71.63,68.58 92.47,68.58 R10.1 | R10.1 R9.1 | 124.95,66.31 122.93,68.33 97.29,68.33 96.05,67.09 R10.1
N$106
  Top 0.254: T1.B 50.68,37.75 R11.2
N$107
  Top 0.254: T2.B 45.25,37.76 R12.2
N$108
  Top 0.254: R13.2 96.31,40.85 T3.B
N$109
  Top 0.254: SHFTREG4.15 57.68,22.48 52.96,22.48 50.71,24.72 R11.1
N$110
  Top 0.254: R12.1 50.08,30.93 50.08,24.46 52.7,21.84 55.89,21.84 57.64,20.1 57.64,17.67 63.89,11.42 SHFTREG4.1
N$111
  Top 0.254: T3.C 97.31,44.77 IN3.C
N$112
  Top 0.254: SHFTREG4.2 61.58,11.19 63.41,9.36 80.14,9.36 89.92,19.14 89.92,20.58 91.44,22.1 93.73,22.1 96.31,24.68 R13.1
N$113
  Top 0.254: R14.1 96.94,31.4 96.94,24.42 92.46,19.94 92.46,19.14 91.78,18.46 90.14,18.46 80.41,8.73 61.5,8.73 59.04,11.19 SHFTREG4.3
N$114
  Top 0.254: T4.C 103.12,58.34 IN4.C
N$116
  Top 0.254: R14.2 102.12,40.85 T4.B
N$117
  Top 0.254: T2.C 46.2,46.66 48,48.46 IN2.C
RCK
  Bottom 0.254: SHFTREG3.12 120.02,29.55 120.02,22.48 118.95,21.42 101.61,21.42 99.82,19.62 99.06,19.62 | 99.06,19.62 ARDUINO_NANO.20 | 53.8,18.74 SHFTREG4.12 53.96,18.81 55.79,20.64 65.98,20.64 69.36,24.02 69.36,29.67 71.19,31.5 SHFTREG2.12 | 53.8,18.74 56.54,16 95.44,16 99.06,19.62 | SHFTREG1.12 22.1,28.82 22.1,22.61 23.44,21.27 51.04,21.27 53.57,18.74 53.8,18.74
SCK  (via drill 0.35)
  Top 0.254: SHFTREG4.11 51.19,16.25 v54.1,13.34 | v68.2,13.34 68.2,26.2 SHFTREG2.11
  Bottom 0.254: SHFTREG3.11 124.21,27.17 124.21,22.1 122.89,20.78 106.06,20.78 104.9,19.62 ARDUINO_NANO.22 104,19.24 100,15.24 54.76,15.24 SHFTREG4.11 50.96,18.81 49.13,20.64 23.18,20.64 21.34,22.48 21.34,27.04 SHFTREG1.11 | v54.1,13.34 v68.2,13.34
SCL
  Top 0.254: RTC.3 76.56,6.18 76.56,6.19 77.6,7.24 101.14,7.24 ARDUINO_NANO.9
SDA
  Top 0.254: RTC.2 74.02,3.64 74.02,3.62 75.73,1.91 104.78,1.91 106.54,3.67 ARDUINO_NANO.8
SER1  (via drill 0.35)
  Top 0.254: SHFTREG1.14 23.77,36.81 24.77,35.81 24.77,23.62 29.34,19.05 v34.67,19.05 | ARDUINO_NANO.21 101.46,18.78 v96.77,14.1
  Bottom 0.254: v34.67,19.05 39.24,14.48 96.39,14.48 v96.77,14.1
SER2  (via drill 0.35)
  Top 0.254: SHFTREG1.9 22.05,24.11 v24,22.16
  Bottom 0.254: v24,22.16 66.36,22.16 68.73,24.53 68.73,34.35 SHFTREG2.14
SER3
  Bottom 0.254: SHFTREG3.14 119.38,34 119.38,22.86 118.57,22.05 73.25,22.05 SHFTREG2.9
SER4  (via drill 0.35)
  Top 0.254: v91.06,16.89 93.34,16.89 95.22,18.76 95.22,20.1 96.45,21.34 120.4,21.34 122.19,23.13 SHFTREG3.9
  Bottom 0.254: SHFTREG4.14 60.73,16.89 v91.06,16.89
VIN  (1 unrouted)
  Top 0.305: 12V.2 15,14.54 HV_POWER.VIN
  Bottom 0.254: HV_POWER.VIN 24.02,12.33 VREG.1 24.16,9.88 C12.2

### Text on the board
bPlace: HIGH VOLTAGE! | HIGH VOLTAGE! | HIGH VOLTAGE! | github.com/nsafran1217 | BOT ROW | GND | JLCJLCJLCJLC | Do not touch / board while / powered! | Nathan Safran - 4/2020